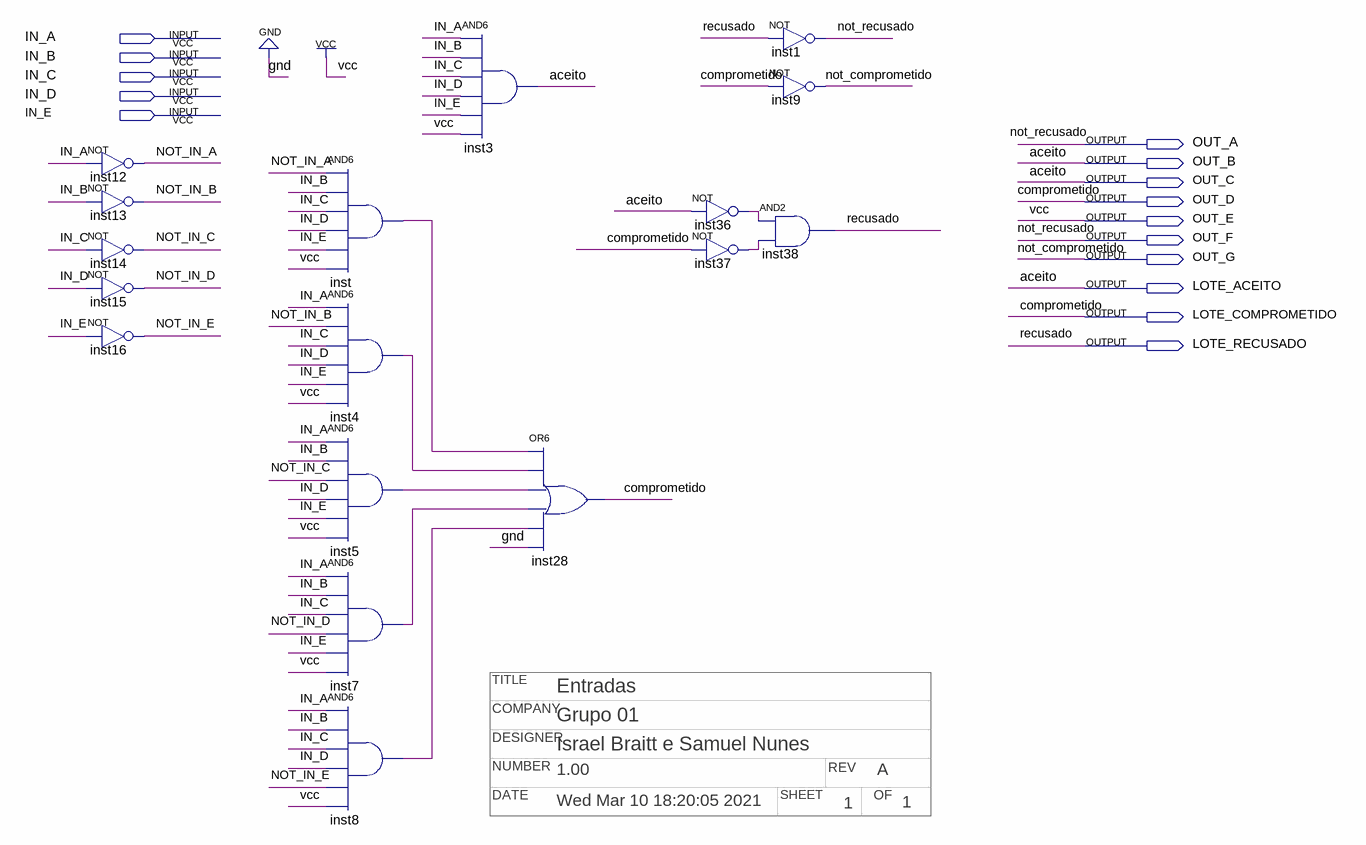
[diagram p0: schematic sheet]
// Quartus schematic Entradas.bdf as structural Verilog: 17 symbols, 15 pins
// Title block: COMPANY: Grupo 01; DATE: Wed Mar 10 18:20:05 2021; DESIGNER: Israel Braitt e Samuel Nunes; NUMBER: 1.00; OF: 1; REV: A; SHEET: 1; TITLE: Entradas
module Entradas (
  input  IN_A,
  input  IN_B,
  input  IN_C,
  input  IN_D,
  input  IN_E,
  output OUT_A,
  output OUT_B,
  output OUT_C,
  output OUT_D,
  output OUT_E,
  output OUT_F,
  output OUT_G,
  output LOTE_ACEITO,
  output LOTE_COMPROMETIDO,
  output LOTE_RECUSADO
);

  wire inst4_out, inst5_out, inst7_out, inst8_out, inst36_out, inst37_out, inst_out, NOT_IN_A, NOT_IN_B,
       NOT_IN_C, NOT_IN_D, NOT_IN_E;

  not inst12 (NOT_IN_A, IN_A);
  not inst13 (NOT_IN_B, IN_B);
  not inst14 (NOT_IN_C, IN_C);
  not inst15 (NOT_IN_D, IN_D);
  not inst16 (NOT_IN_E, IN_E);
  and inst (inst_out, NOT_IN_A, IN_B, IN_C, IN_D, IN_E, 1'b1);
  and inst4 (inst4_out, IN_A, NOT_IN_B, IN_C, IN_D, IN_E, 1'b1);
  and inst5 (inst5_out, IN_A, IN_B, NOT_IN_C, IN_D, IN_E, 1'b1);
  and inst7 (inst7_out, IN_A, IN_B, IN_C, NOT_IN_D, IN_E, 1'b1);
  and inst8 (inst8_out, IN_A, IN_B, IN_C, IN_D, NOT_IN_E, 1'b1);
  and inst3 (LOTE_ACEITO, IN_A, IN_B, IN_C, IN_D, IN_E, 1'b1);
  or inst28 (LOTE_COMPROMETIDO, inst_out, inst4_out, inst5_out, inst7_out, inst8_out, 1'b0);
  not inst36 (inst36_out, LOTE_ACEITO);
  and inst38 (LOTE_RECUSADO, inst36_out, inst37_out);
  not inst37 (inst37_out, LOTE_COMPROMETIDO);
  not inst1 (OUT_A, LOTE_RECUSADO);
  not inst9 (OUT_G, LOTE_COMPROMETIDO);

  assign OUT_B = LOTE_ACEITO;
  assign OUT_C = LOTE_ACEITO;
  assign OUT_D = LOTE_COMPROMETIDO;
  assign OUT_E = 1'b1;
  assign OUT_F = OUT_A;

  // Other names for the same wires on the sheet: aceito = LOTE_ACEITO; comprometido = LOTE_COMPROMETIDO;
  //   not_comprometido = OUT_G; not_recusado = OUT_A; recusado = LOTE_RECUSADO
endmodule
